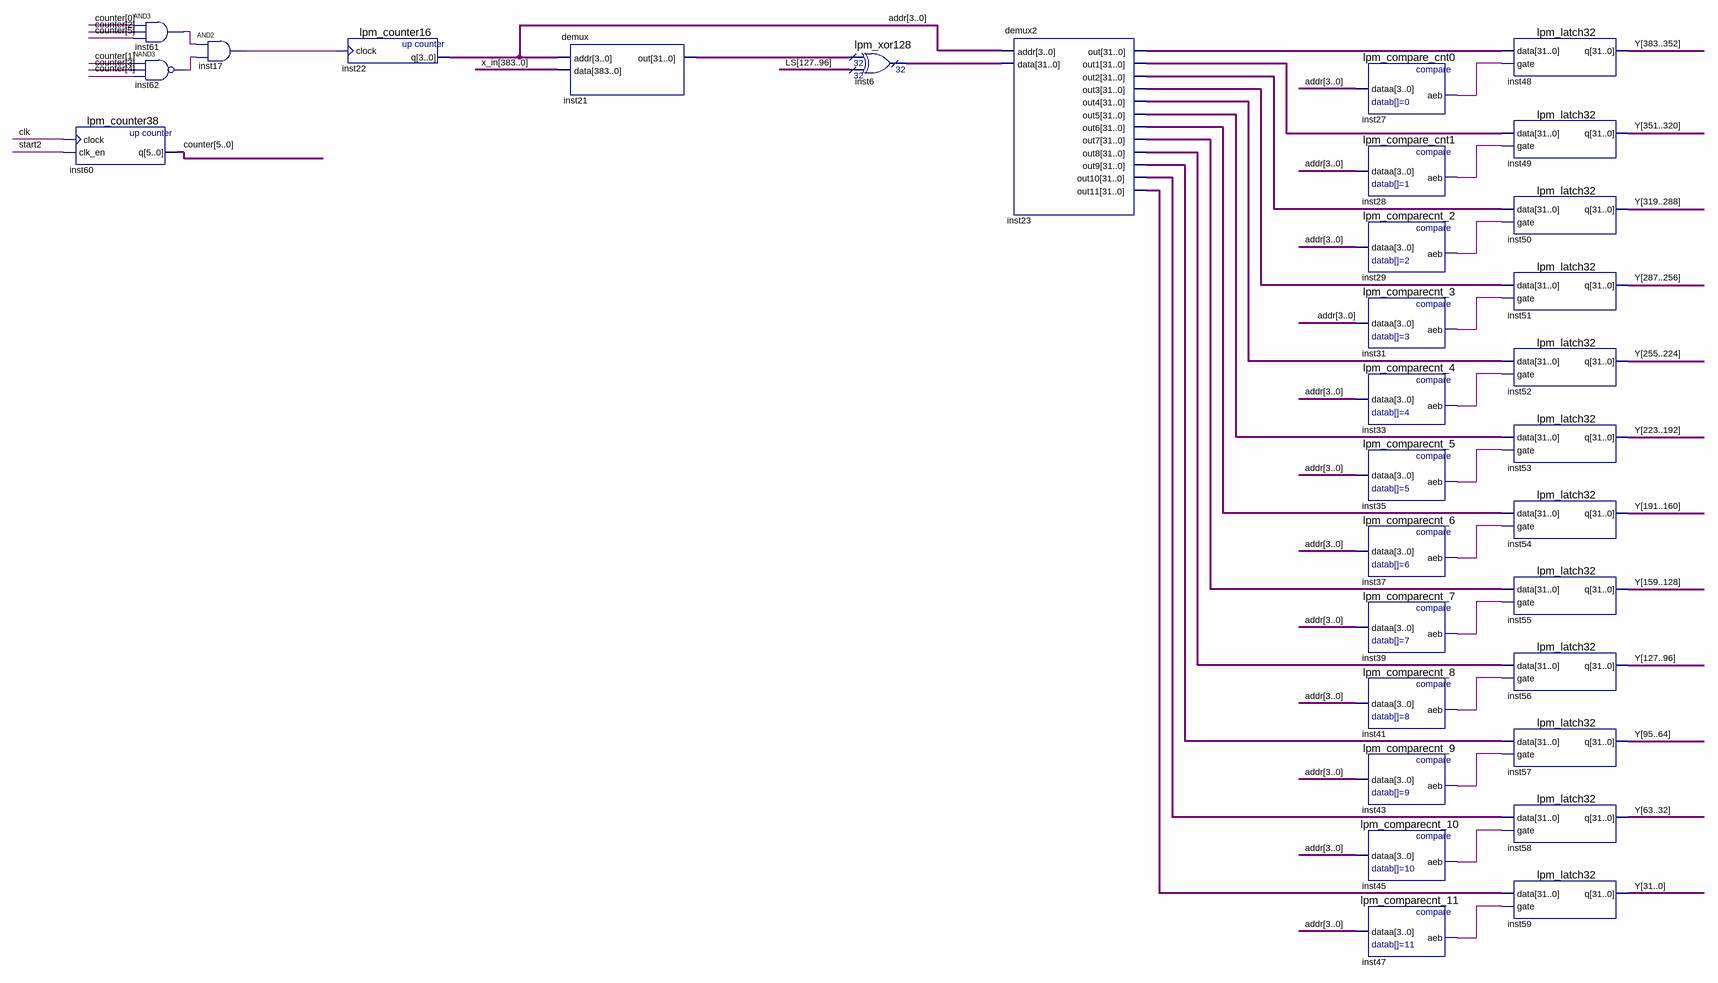
[diagram p0: schematic sheet]
// Quartus schematic test.bdf as structural Verilog: 32 symbols, 0 pins
module test (
);

  wire clk, inst17_out, inst27_aeb, inst28_aeb, inst29_aeb, inst31_aeb, inst33_aeb, inst35_aeb, inst37_aeb,
       inst39_aeb, inst41_aeb, inst43_aeb, inst45_aeb, inst47_aeb, inst61_out, inst62_out, start2;
  wire [3:0] addr;
  wire [5:0] counter;
  wire [31:0] inst6_result, inst21_out, inst23_out, inst23_out1, inst23_out2, inst23_out3, inst23_out4,
       inst23_out5, inst23_out6, inst23_out7, inst23_out8, inst23_out9, inst23_out10, inst23_out11;
  wire [127:96] LS;
  wire [383:0] x_in, Y;

  lpm_counter38 inst60 (.clock(clk), .clk_en(start2), .q(counter));
  and inst61 (inst61_out, counter[0], counter[2], counter[5]);
  nand inst62 (inst62_out, counter[1], counter[3], counter[4]);
  and inst17 (inst17_out, inst61_out, inst62_out);
  lpm_counter16 inst22 (.clock(inst17_out), .q(addr));
  demux inst21 (.addr(addr), .data(x_in), .out(inst21_out));
  lpm_xor128 inst6 (.data0x(inst21_out), .data1x(LS), .result(inst6_result));
  demux2 inst23 (
    .addr(addr), .data(inst6_result), .out(inst23_out), .out1(inst23_out1), .out2(inst23_out2),
    .out3(inst23_out3), .out4(inst23_out4), .out5(inst23_out5), .out6(inst23_out6), .out7(inst23_out7),
    .out8(inst23_out8), .out9(inst23_out9), .out10(inst23_out10), .out11(inst23_out11));
  lpm_compare_cnt0 inst27 (.dataa(addr), .aeb(inst27_aeb));
  lpm_compare_cnt1 inst28 (.dataa(addr), .aeb(inst28_aeb));
  lpm_comparecnt_2 inst29 (.dataa(addr), .aeb(inst29_aeb));
  lpm_comparecnt_3 inst31 (.dataa(addr), .aeb(inst31_aeb));
  lpm_comparecnt_4 inst33 (.dataa(addr), .aeb(inst33_aeb));
  lpm_comparecnt_5 inst35 (.dataa(addr), .aeb(inst35_aeb));
  lpm_comparecnt_6 inst37 (.dataa(addr), .aeb(inst37_aeb));
  lpm_comparecnt_7 inst39 (.dataa(addr), .aeb(inst39_aeb));
  lpm_comparecnt_8 inst41 (.dataa(addr), .aeb(inst41_aeb));
  lpm_comparecnt_9 inst43 (.dataa(addr), .aeb(inst43_aeb));
  lpm_comparecnt_10 inst45 (.dataa(addr), .aeb(inst45_aeb));
  lpm_comparecnt_11 inst47 (.dataa(addr), .aeb(inst47_aeb));
  lpm_latch32 inst48 (.data(inst23_out), .gate(inst27_aeb), .q(Y[383:352]));
  lpm_latch32 inst49 (.data(inst23_out1), .gate(inst28_aeb), .q(Y[351:320]));
  lpm_latch32 inst50 (.data(inst23_out2), .gate(inst29_aeb), .q(Y[319:288]));
  lpm_latch32 inst51 (.data(inst23_out3), .gate(inst31_aeb), .q(Y[287:256]));
  lpm_latch32 inst52 (.data(inst23_out4), .gate(inst33_aeb), .q(Y[255:224]));
  lpm_latch32 inst53 (.data(inst23_out5), .gate(inst35_aeb), .q(Y[223:192]));
  lpm_latch32 inst54 (.data(inst23_out6), .gate(inst37_aeb), .q(Y[191:160]));
  lpm_latch32 inst55 (.data(inst23_out7), .gate(inst39_aeb), .q(Y[159:128]));
  lpm_latch32 inst56 (.data(inst23_out8), .gate(inst41_aeb), .q(Y[127:96]));
  lpm_latch32 inst57 (.data(inst23_out9), .gate(inst43_aeb), .q(Y[95:64]));
  lpm_latch32 inst58 (.data(inst23_out10), .gate(inst45_aeb), .q(Y[63:32]));
  lpm_latch32 inst59 (.data(inst23_out11), .gate(inst47_aeb), .q(Y[31:0]));
endmodule
